# EAGLE design main (EAGLE 7.7.0)
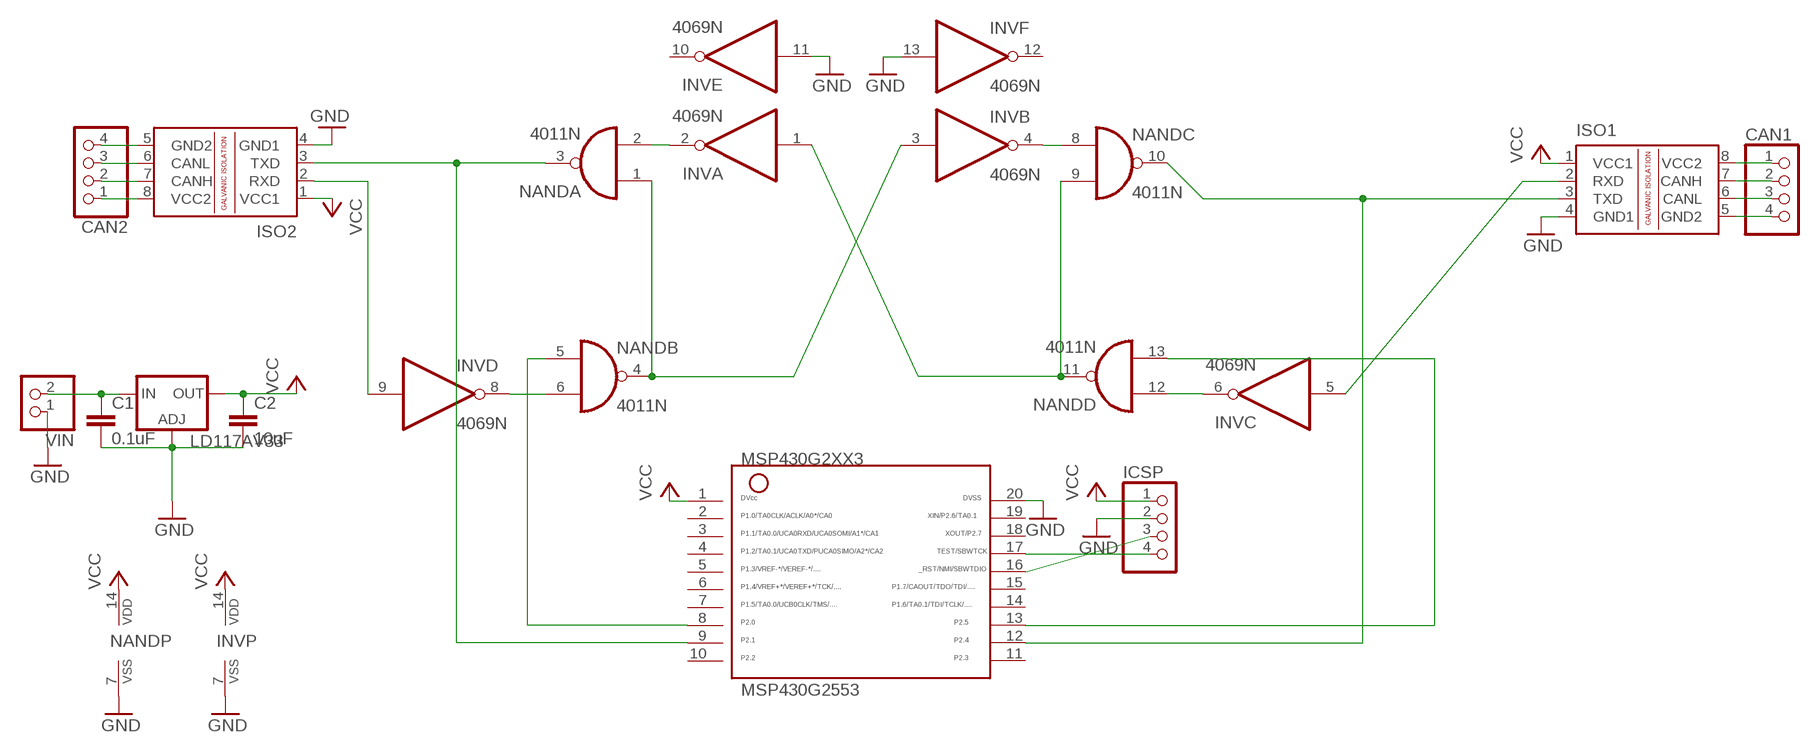
[diagram p0: schematic, sheet 1]

## Parts
C1  0.1uF  C-EU025-024X044  [C025-024X044]
C2  10uF  C-EU025-024X044  [C025-024X044]
CAN1  PINHD-1X4  [1X04]
CAN2  PINHD-1X4  [1X04]
ICSP  PINHD-1X4  [1X04]
INV  4069N  [DIL14]
ISO1  ISO1050DUB  [DUB-R-PDSO-G8]
ISO2  ISO1050DUB  [DUB-R-PDSO-G8]
LD117AV33  LD117AV33  [TO220L1]
MSP430G2553  G2XX3---N20  [N20]
NAND  4011N  [DIL14]
VIN  PINHD-1X2  [1X02]

## Nets
GND: C1.2 C2.2 ICSP.2 INV.7(P:VSS) INV.11(E:I) INV.13(F:I) ISO1.4(GND1) ISO2.4(GND1) LD117AV33.1(ADJ) MSP430G2553.20 NAND.7(P:VSS) VIN.1
N$1: ICSP.3 MSP430G2553.16
N$2: ICSP.4 MSP430G2553.17
N$3: INV.8(D:O) NAND.6(B:I1)
N$4: INV.2(A:O) NAND.2(A:I1)
N$5: INV.4(B:O) NAND.8(C:I0)
N$6: INV.6(C:O) NAND.12(D:I0)
N$7: INV.1(A:I) NAND.9(C:I1) NAND.11(D:O)
N$8: INV.3(B:I) NAND.1(A:I0) NAND.4(B:O)
N$9: CAN2.1 ISO2.8(VCC2)
N$10: CAN2.2 ISO2.7(CANH)
N$11: CAN2.3 ISO2.6(CANL)
N$12: CAN2.4 ISO2.5(GND2)
N$13: CAN1.1 ISO1.8(VCC2)
N$14: CAN1.2 ISO1.7(CANH)
N$15: CAN1.3 ISO1.6(CANL)
N$16: CAN1.4 ISO1.5(GND2)
N$18: INV.5(C:I) ISO1.2(RXD)
N$20: INV.9(D:I) ISO2.2(RXD)
N$21: MSP430G2553.8 NAND.5(B:I0)
N$22: MSP430G2553.13 NAND.13(D:I1)
N$23: C1.1 LD117AV33.3(IN) VIN.2
N$24: ISO2.3(TXD) MSP430G2553.9 NAND.3(A:O)
N$25: ISO1.3(TXD) MSP430G2553.12 NAND.10(C:O)
VCC: C2.1 ICSP.1 INV.14(P:VDD) ISO1.1(VCC1) ISO2.1(VCC1) LD117AV33.2(OUT) MSP430G2553.1 NAND.14(P:VDD)
Unconnected: INV.10(E:O) INV.12(F:O) MSP430G2553.2 MSP430G2553.3 MSP430G2553.4 MSP430G2553.5 MSP430G2553.6 MSP430G2553.7 MSP430G2553.10 MSP430G2553.11 MSP430G2553.14 MSP430G2553.15 MSP430G2553.18 MSP430G2553.19

## Library data of the parts
C1 C2 = rcl:C-EU: CAPACITOR, European symbol
CAN1 CAN2 ICSP = pinhead:PINHD-1X4: PIN HEADER
INV = 40xx:4069: Hex INVERTER
ISO1 ISO2 = texas:ISO1050: ISOLATED CAN TRANSCEIVER Source: http://focus.ti.com/lit/ds/symlink/iso1050.pdf; MPN: ISO1050DUBR; OC_FARNELL: 1755712; OC_NEWARK: 14R9899
LD117AV33 = v-reg:LD117A?*: Low drop fixed and adjustable positive voltage regulators 1 A Source: http://www.st.com/stonline/products/literature/ds/7194/ld1117axx.pdf
MSP430G2553 = TI_MSP430_v16:G2XX3---N20: MSP430G2XX1 PDIP (N) 20 Pin Package
NAND = 40xx:4011: Quad 2-input NAND
VIN = pinhead:PINHD-1X2: PIN HEADER

## Board
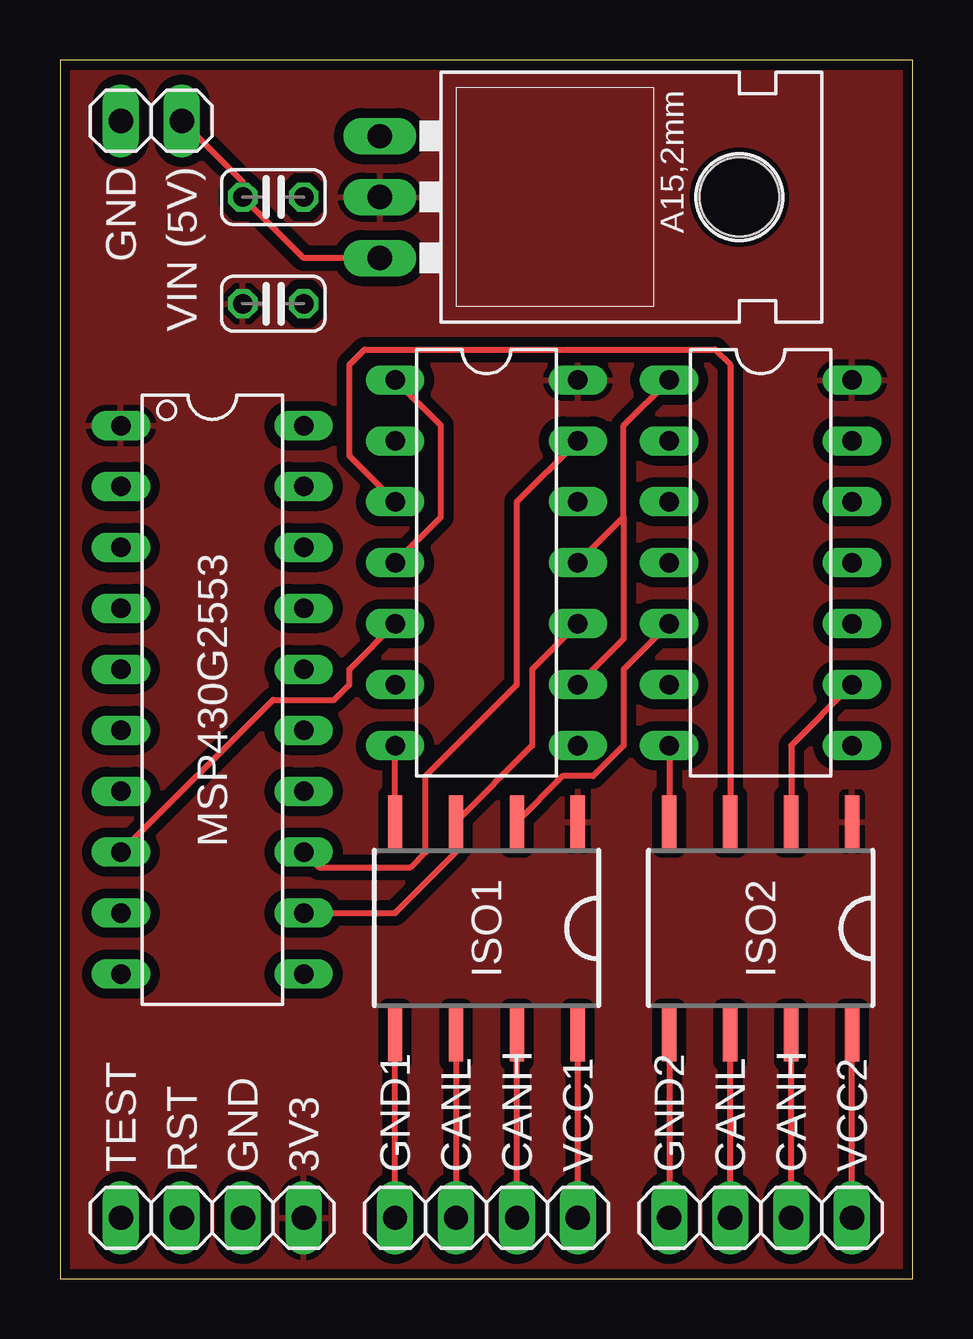
[diagram p1: board, top side]
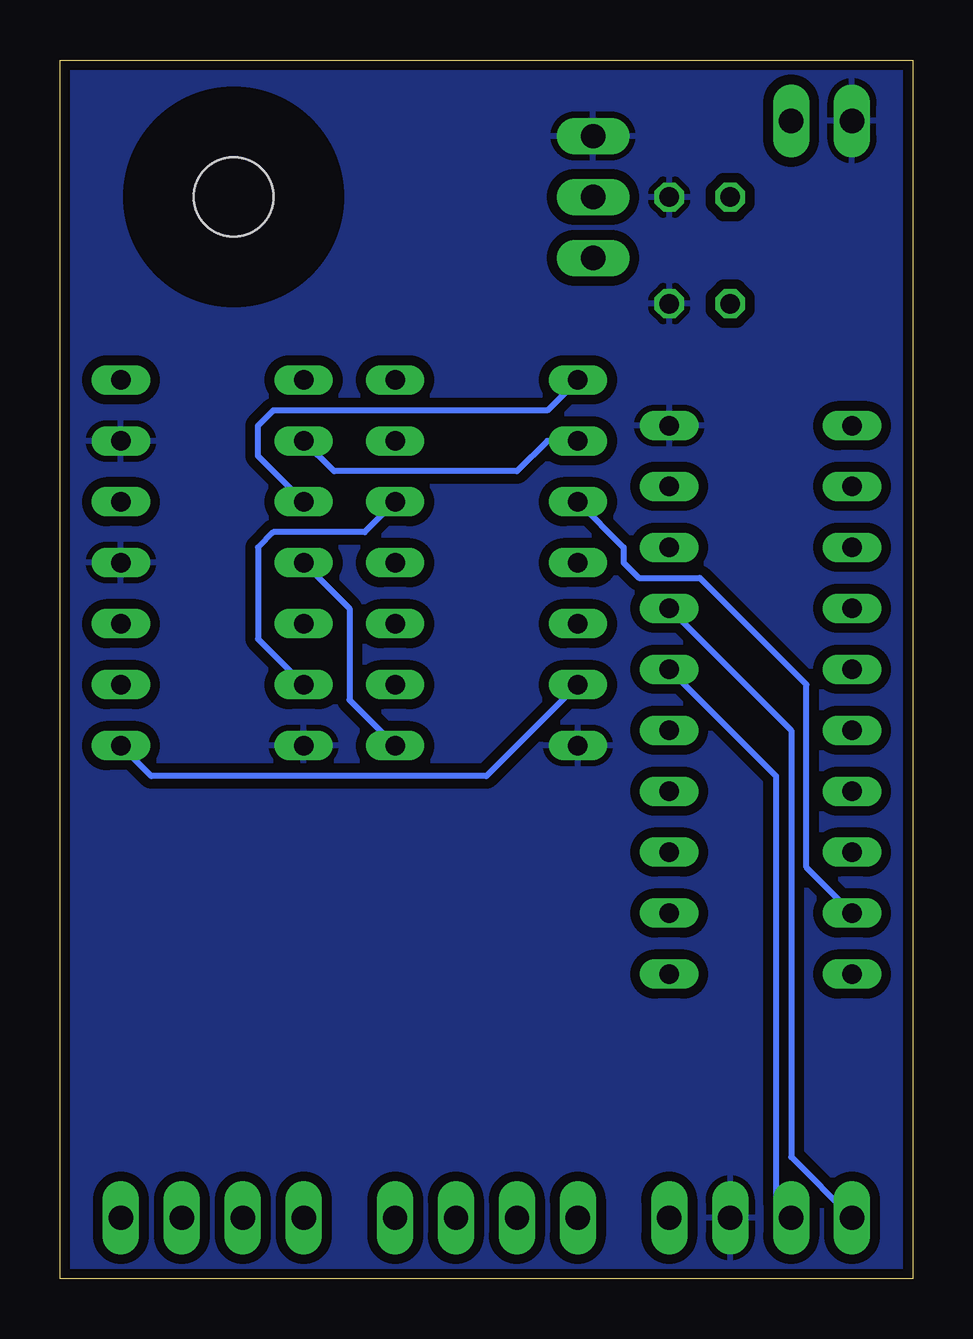
[diagram p2: board, bottom side, seen from below]

Size 35.56 x 50.8 mm. Coordinates in mm from the lower left corner, seen from the top.
Outline: 0,0 35.56,0 35.56,50.8 0,50.8 0,0
Copper layers (1*16): Top 0.0356mm / dielectric 1.5011mm / Bottom 0.0356mm
Design rules "oshpark-2layer": minimum track width 6mil, minimum drill 13mil, track to track 6mil, track to pad 6mil, pad to pad 6mil, via to via 6mil, smd to smd 6mil, copper to edge 15mil, drill to drill 6mil, minimum pad ring 7mil, minimum via ring 7mil, stop-mask expansion 2.5mil, vias tented up to drill 0mil, thermal gap 10mil

### Footprints (pad centres in the part's own frame; a part is rotated, then mirrored left to right if it is on the bottom)
C025-024X044 = drill 0.813 octagon: 1 -1.27,0; 2 1.27,0
1X04 = drill 1.016 long: 1 -3.81,0; 2 -1.27,0; 3 1.27,0; 4 3.81,0
DIL14 = drill 0.813 long: 1 -7.62,-3.81; 2 -5.08,-3.81; 3 -2.54,-3.81; 4 0,-3.81; 5 2.54,-3.81; 6 5.08,-3.81; 7 7.62,-3.81; 8 7.62,3.81; 9 5.08,3.81; 10 2.54,3.81; 11 0,3.81; 12 -2.54,3.81; 13 -5.08,3.81; 14 -7.62,3.81
DUB-R-PDSO-G8 = smd 0.6 x 2.2: 1 -3.81,-4.445; 2 -1.27,-4.445; 3 1.27,-4.445; 4 3.81,-4.445; 5 3.81,4.445; 6 1.27,4.445; 7 -1.27,4.445; 8 -3.81,4.445
TO220L1 = drill 1.016 long: 1 -2.54,-3.81; 2 0,-3.81; 3 2.54,-3.81 | hole 3.302: 0,11.176
N20 = drill 0.813 long: 1 -11.43,-3.81; 2 -8.89,-3.81; 3 -6.35,-3.81; 4 -3.81,-3.81; 5 -1.27,-3.81; 6 1.27,-3.81; 7 3.81,-3.81; 8 6.35,-3.81; 9 8.89,-3.81; 10 11.43,-3.81; 11 11.43,3.81; 12 8.89,3.81; 13 6.35,3.81; 14 3.81,3.81; 15 1.27,3.81; 16 -1.27,3.81; 17 -3.81,3.81; 18 -6.35,3.81; 19 -8.89,3.81; 20 -11.43,3.81
1X02 = drill 1.016 long: 1 -1.27,0; 2 1.27,0

### Placement (x,y rotation side)
C1  8.89,45.09 0 top
C2  8.89,40.64 0 top
CAN1  17.78,2.54 180 top
CAN2  29.21,2.54 180 top
ICSP  6.35,2.54 180 top
INV  29.21,29.84 270 top
ISO1  17.78,14.61 180 top
ISO2  29.21,14.61 180 top
LD117AV33  17.14,45.09 270 top
MSP430G2553  6.35,24.13 270 top
NAND  17.78,29.84 270 top
VIN  3.81,48.26 0 top

### Tracks (layer width: path | path; a pad name or v marks a point on that pad's centre or on a via)
GND
  Top 0.254: INV.7 ISO2.4 | ISO1.4 NAND.7
  pour Bottom (isolate 0.406): 0,0 0,50.8 35.56,50.8 35.56,0
N$1
  Bottom 0.254: ICSP.3 5.71,3.17 5.71,20.95 MSP430G2553.16
N$2
  Bottom 0.254: ICSP.4 5.08,5.08 5.08,22.86 MSP430G2553.17
N$3
  Bottom 0.254: NAND.6 17.78,20.95 31.75,20.95 INV.8
N$4
  Bottom 0.254: NAND.2 15.24,34.92 16.51,33.66 24.13,33.66 INV.2
N$5
  Bottom 0.254: NAND.8 23.5,24.13 23.5,27.94 INV.4
N$6
  Bottom 0.254: NAND.12 22.86,31.11 26.67,31.11 27.3,30.48 27.3,26.67 INV.6
N$7
  Top 0.254: INV.1 23.5,35.56 23.5,31.75 | NAND.11 23.5,31.75 | NAND.9 23.5,26.67 23.5,31.75
N$8
  Top 0.254: NAND.4 15.88,31.75 15.88,35.56 NAND.1
  Bottom 0.254: INV.3 27.3,34.29 27.3,35.56 26.67,36.2 15.24,36.2 NAND.1
N$9
  Top 0.254: CAN2.1 ISO2.8
N$10
  Top 0.254: CAN2.2 ISO2.7
N$11
  Top 0.254: CAN2.3 ISO2.6
N$12
  Top 0.254: ISO2.5 CAN2.4
N$13
  Top 0.254: CAN1.1 ISO1.8
N$14
  Top 0.254: CAN1.2 ISO1.7
N$15
  Top 0.254: ISO1.6 CAN1.3
N$16
  Top 0.254: CAN1.4 ISO1.5
N$18
  Top 0.254: ISO1.2 20.95,20.95 22.23,20.95 23.5,22.23 23.5,25.4 INV.5
N$20
  Top 0.254: ISO2.2 30.48,22.23 INV.9
N$21
  Top 0.254: NAND.5 12.06,25.4 12.06,24.77 11.43,24.13 8.89,24.13 MSP430G2553.8
N$22
  Top 0.254: NAND.13 19.05,32.38 19.05,24.77 15.24,20.95 15.24,17.78 14.61,17.14 10.79,17.14 MSP430G2553.13
N$23
  Top 0.254: VIN.2 7.62,45.72 C1.1 10.16,42.55 LD117AV33.3
N$24
  Top 0.254: NAND.3 12.06,34.29 12.06,38.1 12.7,38.73 27.3,38.73 27.94,38.1 ISO2.3
  Bottom 0.254: MSP430G2553.9 4.45,17.14 4.45,24.77 8.89,29.21 11.43,29.21 12.06,29.84 12.06,30.48 NAND.3
N$25
  Top 0.254: NAND.10 19.68,25.4 19.68,22.23 ISO1.3 16.51,17.78 13.97,15.24 MSP430G2553.12
VCC
  pour Top (isolate 0.406): 0,0 0,50.8 35.56,50.8 35.56,0

### Text on the board
tPlace: GND | VIN (5V) | ISO1 | ISO2 | TEST | RST | GND | 3V3 | GND1 | CANL | CANH | VCC1 | GND2 | CANL | CANH | VCC2